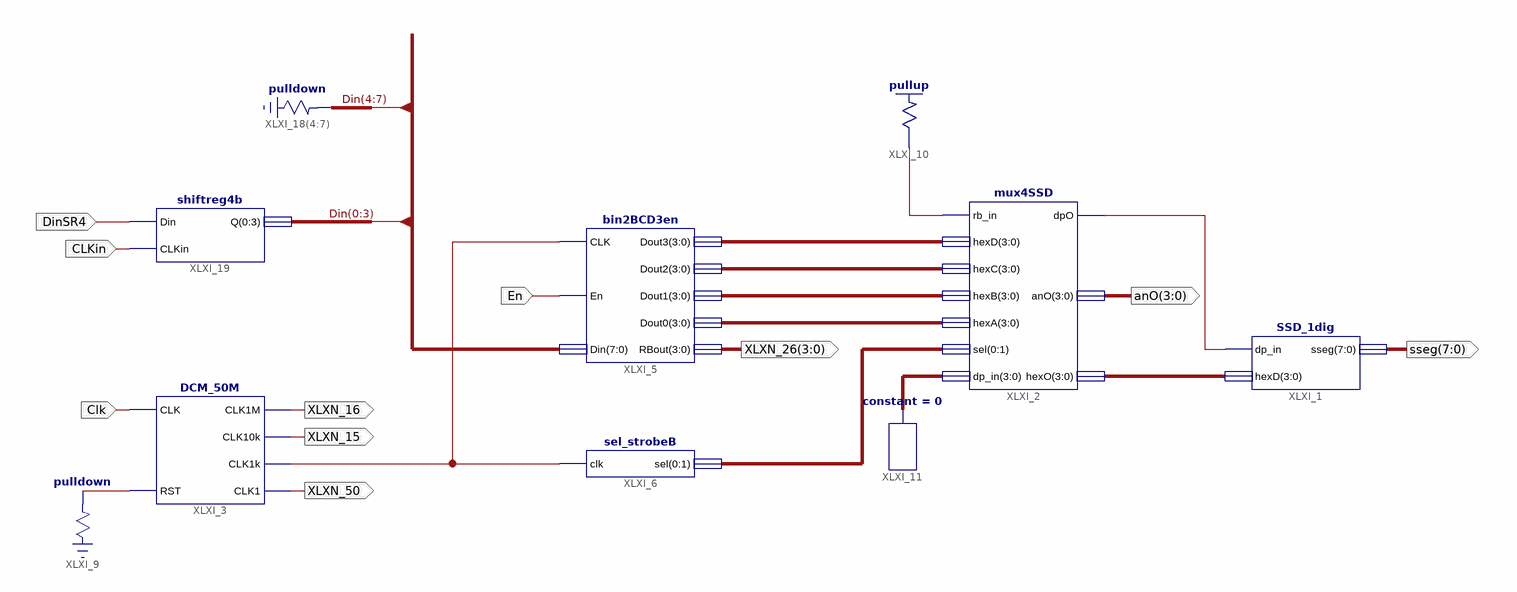
[diagram p0: schematic sheet 1]
// Xilinx ISE schematic Lab7Exp6.sch (spartan3e) as structural Verilog: 10 symbols, 10 ports
module Lab7Exp6 (
  input  En,
  input  Clk,
  input  DinSR4,
  input  CLKin,
  output [3:0] anO,
  output [7:0] sseg,
  output XLXN_15,
  output XLXN_16,
  output [3:0] XLXN_26,
  output XLXN_50
);

  wire XLXN_18, XLXN_21, XLXN_22, XLXN_38;
  wire [1:0] XLXN_12;
  wire [3:0] XLXN_1, XLXN_5, XLXN_6, XLXN_9, XLXN_11, XLXN_37;
  wire [7:0] Din;

  SSD_1dig XLXI_1 (.dp_in(XLXN_38), .hexD(XLXN_1), .sseg(sseg));
  mux4SSD XLXI_2 (
    .rb_in(XLXN_22), .hexD(XLXN_11), .hexC(XLXN_9), .hexB(XLXN_6), .hexA(XLXN_5),
    .sel({XLXN_12[0], XLXN_12[1]}), .dp_in(XLXN_37), .dpO(XLXN_38), .anO(anO), .hexO(XLXN_1));
  DCM_50M XLXI_3 (.CLK(Clk), .RST(XLXN_18), .CLK1M(XLXN_16), .CLK10k(XLXN_15), .CLK1k(XLXN_21), .CLK1(XLXN_50));
  \pulldown  XLXI_9 (.O(XLXN_18));
  \pullup  XLXI_10 (.O(XLXN_22));
  bin2BCD3en XLXI_5 (
    .CLK(XLXN_21), .En(En), .Din(Din), .Dout3(XLXN_11), .Dout2(XLXN_9), .Dout1(XLXN_6), .Dout0(XLXN_5),
    .RBout(XLXN_26));
  sel_strobeB XLXI_6 (.clk(XLXN_21), .sel({XLXN_12[0], XLXN_12[1]}));
  constant #(.CValue("0")) XLXI_11 (.O(XLXN_37));
  \pulldown  XLXI_18[4:7] (.O({Din[4], Din[5], Din[6], Din[7]}));
  shiftreg4b XLXI_19 (.Din(DinSR4), .CLKin(CLKin), .Q({Din[0], Din[1], Din[2], Din[3]}));
endmodule
